# Altium schematic sheet Power Supply Unit (Main).SchDoc: Power Supply Unit
size A4; SPICEModelCacheSEIOAEZJ: <root> / <DocumentId>SEIOAEZJ</DocumentId> / </root>; Revision: 1; SheetNumber: 2; SheetTotal: 5; Units: mm
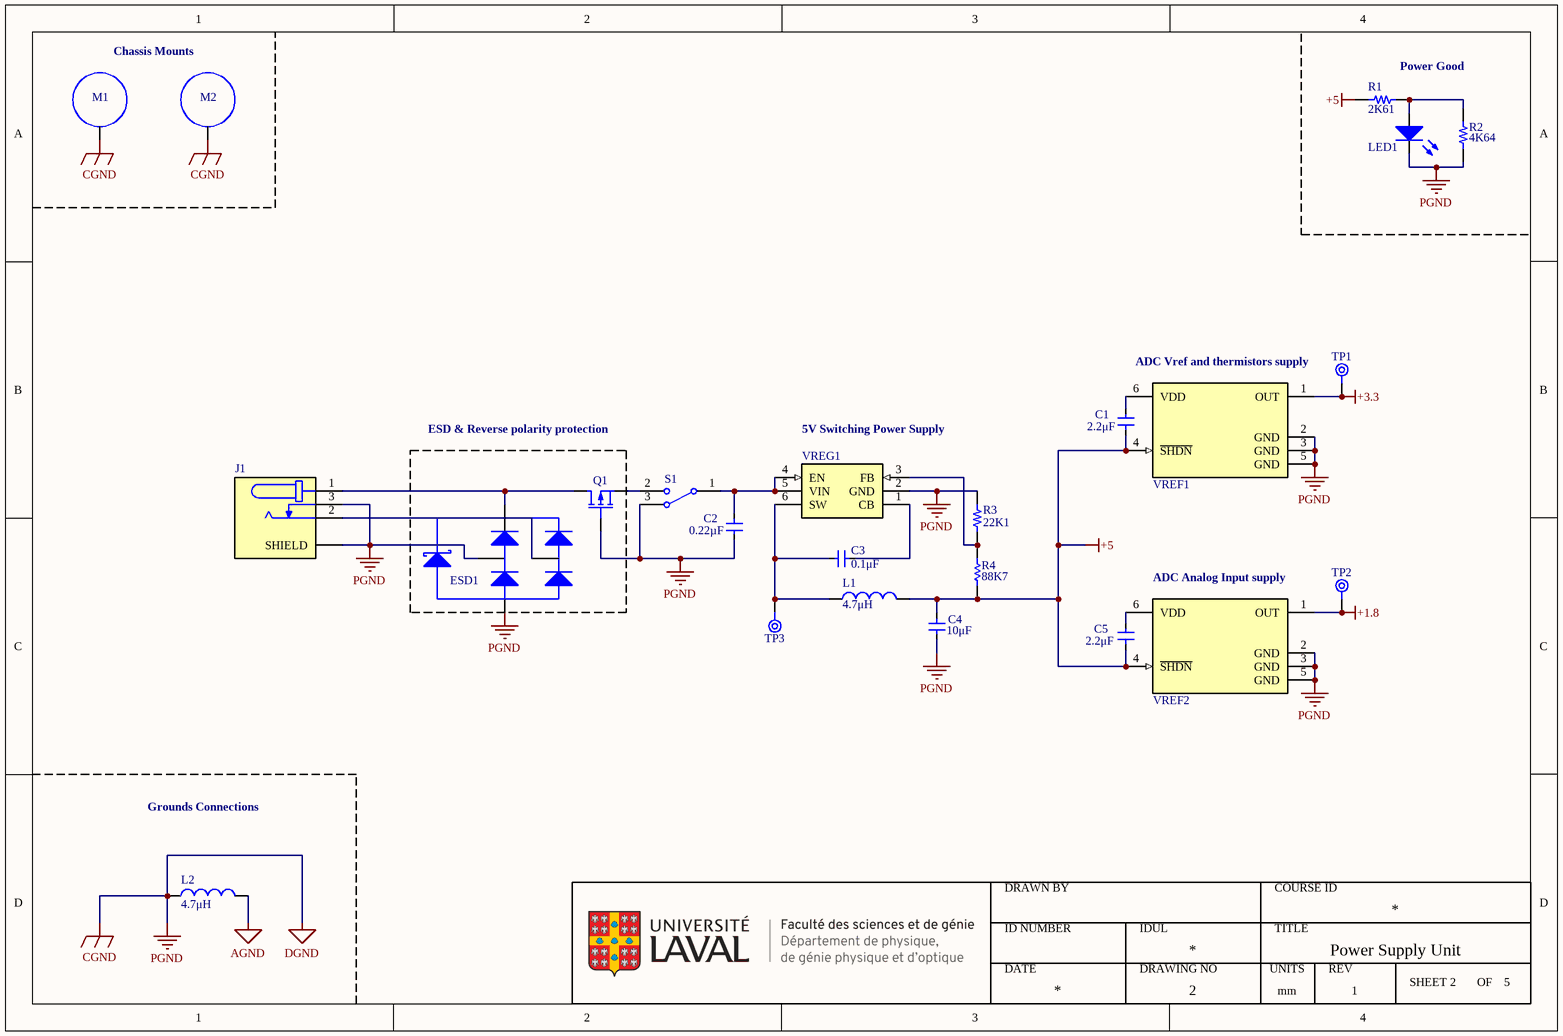
[diagram p0: Power Supply Unit (Main).SchDoc]

## Parts
C1  value 2.2μF  [Cap Ceramic 2.2 uF 6.3V SMT 0603]  (hidden comment: Cap Ceramic 2.2 uF SMT 0603)
C2  Capacitance: 0.22µF  [Cap Ceramic 0.22 uF 25V SMT 0603]  (hidden comment: Cap Ceramic 0.22 uF SMT 0603)
C3  Capacitance: 0.1μF  [Cap Ceramic 0.1 uF 50V SMT 0603]  (hidden comment: Cap Ceramic 0.1 uF SMT 0603)
C4  Capacitance: 10μF  [Cap Ceramic 10 uF SMT 0603]  (hidden comment: GRM188R60J106KE47J)
C5  value 2.2μF  [Cap Ceramic 2.2 uF 6.3V SMT 0603]  (hidden comment: Cap Ceramic 2.2 uF SMT 0603)
ESD1  PRTR5V0U2X,215  [TVS Diode Array Ultra-Low Capacitance]  (value not drawn)
J1  PJ-090BH  [DC Power Jack 2.5 mm]  (value not drawn)
L1  value 4.7μH  [Inductor 4.7 uH SMT 0603]  (hidden comment: ILSB0603ER4R7K)
L2  value 4.7μH  [Inductor 4.7 uH SMT 0603]  (hidden comment: ILSB0603ER4R7K)
LED1  151033GS03000  [Led 3 mm Vertical Clear]  (value not drawn)
M1  R30-3000702  [Standoff M3 7mm Brass]  (value not drawn)
M2  R30-3000702  [Standoff M3 7mm Brass]  (value not drawn)
Q1  IRLML9303TRPBF  [IRLML9303TRPBF]  (value not drawn)
R1  value 2K61  [Resistor Yaego SMT 0603]  (hidden comment: RC0603FR-072K61L)
R2  value 4K64  [Resistor Yaego SMT 0603]  (hidden comment: RC0603FR-074K64L)
R3  Resistance: 22K1  [Resistor Yaego SMT 0603]  (hidden comment: Res 22K1 SMT 0603)
R4  Resistance: 88K7  [Res 88K7 1% SMT 0603]  (hidden comment: Res 88K7 SMT 0603)
S1  TL2230EEF100  [SW DPDT Pushbutton]  (value not drawn)
TP1  Test Point  [SQ Pad]  (value not drawn)  (no BOM)
TP2  Test Point  [SQ Pad]  (value not drawn)  (no BOM)
TP3  Test Point  [SQ Pad]  (value not drawn)  (no BOM)
VREF1  Voltage Reference Series Fixed 3.3V  [MCP1501T-XXE/CHY]  (value not drawn)
VREF2  Voltage Reference Series Fixed 1.8V  [MCP1501T-XXE/CHY]  (value not drawn)
VREG1  Buck Adjustable Switching Reg Pos  [LMR50410YFQDBVRQ1]  (value not drawn)

## Blocks framed on the sheet
ESD & Reverse polarity protection: ESD1 Q1

## Nets
+1.8: TP2.1(TP) VREF2.1(OUT)
+3.3: TP1.1(TP) VREF1.1(OUT)
+5: C1.2 C4.2 C5.2 L1.2 R1.1 R4.2 VREF1.4(~{SHDN}) VREF2.4(~{SHDN})
AGND: L2.2
CGND: C2.1 C4.1 ESD1.1(GND) ESD1.2(I/O_1) J1.3 J1.S1(SHIELD) L2.1 LED1.1(K) M1.1(CGND) M2.1(CGND) Q1.2(G) R2.1 R3.2 S1.3(NO1) VREF1.2(GND) VREF1.3(GND) VREF1.5(GND) VREF2.2(GND) VREF2.3(GND) VREF2.5(GND) VREG1.2(GND)  [also labelled DGND, PGND]
NetC1_1: C1.1 VREF1.6(VDD)
NetC2_2: C2.2 S1.1(NC1) VREG1.4(EN) VREG1.5(VIN)
NetC3_1: C3.1 L1.1 TP3.1(TP) VREG1.6(SW)
NetC3_2: C3.2 VREG1.1(CB)
NetC5_1: C5.1 VREF2.6(VDD)
NetESD1_3: ESD1.3(I/O_2) J1.2
NetESD1_4: ESD1.4(VCC) J1.1 Q1.1(D)
NetLED1_2: LED1.2(A) R1.2 R2.2
NetQ1_3: Q1.3(S) S1.2(COM1)
NetR3_1: R3.1 R4.1 VREG1.3(FB)

## Notes on the sheet
- Chassis Mounts
- (near R1) Power Good
- ADC Vref and thermistors supply
- (near VREG1) 5V Switching Power Supply
- (near VREF2) ADC Analog Input supply
- Grounds Connections
- DRAWN BY
- COURSE ID
- ID NUMBER
- DATE
- IDUL
- DRAWING NO
- TITLE
- UNITS
- REV
- SHEET
- OF

## Library data of the parts
C1 C5 = Cap Ceramic 2.2 uF SMT 0603: 2.2 µF ±10% 6.3V Ceramic Capacitor X7R 0603 (1608 Metric); Part Number: CC0603KRX7R5BB225; manufacturer: Yageo; Applications: General Purpose; ComponentLink1Description: Datasheet; ComponentLink1URL: *; componentlink2description: DigiKey Link; componentlink2url: https://www.digikey.com/en/products/detail/yageo/CC0603KRX7R5BB225/5195203; Device Package: 0603 (1608 Metric); lastupdated: 2023-03-06 20:08:32; Lifecycle Status: Active; Minimum Order: 1; Mounting Type: Surface Mount, MLCC; Operating Temperature: -55°C ~ 125°C; Package / Case: 0603 (1608 Metric); packaging: TapeAndReel; partid: 41539; Part Status: Active; price: 0.01; series: CC; Size / Dimension: 0.063" L x 0.031" W (1.60mm x 0.80mm); Temperature Coefficient: X7R; Thickness (Max): 0.035" (0.90mm); Tolerance: ±10%; Voltage - Rated: 6.3V; Supplier 1: Digi-Key; Supplier Part Number 1: 311-1795-1-ND; Supplier 2: Digi-Key; Supplier Part Number 2: 311-1795-6-ND; Supplier 3: Digi-Key; Supplier Part Number 3: 311-1795-2-ND
C2 = Cap Ceramic 0.22 uF SMT 0603: 0.22 µF ±10% 25V Ceramic Capacitor X7R 0603 (1608 Metric); Part Number: GRM188R71E224KA88D; manufacturer: Murata Electronics; Applications: General Purpose; componentlink1description: Datasheet; componentlink1url: https://www.murata.com/~/media/webrenewal/support/library/catalog/products/capacitor/mlcc/c02e.ashx?la=en-us; componentlink2description: DigiKey Link; componentlink2url: https://www.digikey.com/en/products/detail/murata-electronics/GRM188R71E224KA88D/702554; Device Package: 0603 (1608 Metric); lastupdated: 2023-03-05 20:08:17; Lifecycle Status: Active; Minimum Order: 1; Mounting Type: Surface Mount, MLCC; Operating Temperature: -55°C ~ 125°C; Package / Case: 0603 (1608 Metric); packaging: TapeAndReel; partid: 11196; Part Status: Active; price: 0.01; series: GRM; Size / Dimension: 0.063" L x 0.031" W (1.60mm x 0.80mm); Temperature Coefficient: X7R; Thickness (Max): 0.035" (0.90mm); Tolerance: ±10%; Voltage - Rated: 25V; Supplier 1: Digi-Key; Supplier Part Number 1: 490-3290-1-ND; Supplier 2: Digi-Key; Supplier Part Number 2: 490-3290-6-ND; Supplier 3: Digi-Key; Supplier Part Number 3: 490-3290-2-ND
C3 = Cap Ceramic 0.1 uF SMT 0603: 0.1 µF ±5% 50V Ceramic Capacitor X7R 0603 (1608 Metric); Part Number: CC0603JRX7R9BB104; manufacturer: Yageo; Applications: General Purpose; componentlink1description: Datasheet; componentlink1url: https://www.yageo.com/upload/media/product/productsearch/datasheet/mlcc/UPY-GPHC_X7R_6.3V-to-50V_18.pdf; componentlink2description: DigiKey Link; componentlink2url: https://www.digikey.com/en/products/detail/yageo/CC0603JRX7R9BB104/5195188; Device Package: 0603 (1608 Metric); lastupdated: 2023-03-06 20:08:09; Lifecycle Status: Active; Minimum Order: 1; Mounting Type: Surface Mount, MLCC; Operating Temperature: -55°C ~ 125°C; Package / Case: 0603 (1608 Metric); packaging: TapeAndReel; partid: 12474; Part Status: Active; price: 0.01; series: CC; Size / Dimension: 0.063" L x 0.031" W (1.60mm x 0.80mm); Temperature Coefficient: X7R; Thickness (Max): 0.035" (0.90mm); Tolerance: ±5%; Voltage - Rated: 50V; Supplier 1: Digi-Key; Supplier Part Number 1: 311-1779-1-ND; Supplier 2: Digi-Key; Supplier Part Number 2: 311-1779-6-ND; Supplier 3: Digi-Key; Supplier Part Number 3: 311-1779-2-ND
C4 = Cap Ceramic 10 uF SMT 0603: 10 µF ±10% 6.3V Ceramic Capacitor X5R 0603 (1608 Metric); manufacturer: Murata Electronics; Part Number: GRM188R60J106KE47J; Applications: General Purpose; componentlink2description: DigiKey Link; componentlink2url: https://www.digikey.com/en/products/detail/murata-electronics/GRM188R60J106KE47J/10691412; Device Package: 0603 (1608 Metric); lastupdated: 2023-03-08 20:07:22; Lifecycle Status: Active; Minimum Order: 1; Mounting Type: Surface Mount, MLCC; Operating Temperature: -55°C ~ 85°C; Package / Case: 0603 (1608 Metric); packaging: TapeAndReel; partid: 47219; Part Status: Active; price: 0.01; series: GRM; Size / Dimension: 0.063" L x 0.032" W (1.60mm x 0.80mm); Temperature Coefficient: X5R; Thickness (Max): 0.035" (0.90mm); Tolerance: ±10%; Voltage - Rated: 6.3V; Supplier 1: Digi-Key; Supplier Part Number 1: 490-GRM188R60J106KE47JCT-ND; Supplier 2: Digi-Key; Supplier Part Number 2: 490-GRM188R60J106KE47JDKR-ND; Supplier 3: Digi-Key; Supplier Part Number 3: 490-GRM188R60J106KE47JTR-ND
ESD1 = TVS Diode Array Ultra-Low Capacitance: Clamp Ipp Tvs Diode Surface Mount SOT-143B; Supplier 1: Digi-Key; Supplier Part Number 1: 1727-3884-1-ND; Supplier 2: Digi-Key; Supplier Part Number 2: 1727-3884-6-ND; Supplier 3: Digi-Key; Supplier Part Number 3: 1727-3884-2-ND
J1 = DC Power Jack 2.5 mm Vertical: Power Barrel Connector Jack 2.50mm ID (0.098"), 5.50mm OD (0.217") Through Hole; Current Rating: 5A; Voltage Rating: 25V; Shielding: Shielded; Contact Material: Brass, Copper Alloy; Max Operating Temperature: 85°C; Min Operating Temperature: -25°C; Supplier 1: Digi-Key; Supplier Part Number 1: 102-5562-1-ND; Supplier 2: Digi-Key; Supplier Part Number 2: 102-5562-2-ND; Contact Material - Plating: Silver; Housing Material: Polyamide (PA10T), Nylon 10T
L1 L2 = Inductor 4.7 µH SMT 0603: 4.7 µH Shielded Multilayer Inductor 15 mA 2.1Ohm Max 0603 (1608 Metric); Tolerance: 10%; Core Material: Ferrite; Self Resonant Frequency: 41MHz; Case Code (Imperial): 1206; Min Operating Temperature: -55°C; Max Operating Temperature: 125°C; Width: 1.6mm; Depth: 1.8mm; Weight: 0.000353oz; ComponentLink1Description: Datasheet; ComponentLink1URL: https://www.vishay.com/docs/34029/ilsb1206.pdf; Supplier 1: Digi-Key; Supplier Part Number 1: 541-4369-1-ND; Supplier 2: Digi-Key; Supplier Part Number 2: 541-4369-6-ND
LED1 = LED Green 3mm Vertical: Green 530nm LED Indication - Discrete 3.2V Radial; Supplier 1: Digi-Key; Supplier Part Number 1: 732-5012-ND; Operating Voltage: 3.2V
M1 M2 = Standoff M3 7mm: Hex Standoff Threaded M3x0.5 Brass 0.276" (7.00mm); Supplier 1: Digi-Key; Supplier Part Number 1: 952-1498-ND
Q1 = MOSFET P-Channel 30V SMD: P-Channel 30 V 2.3A (Ta) 1.25W (Ta) Surface Mount Micro3™/SOT-23; Manufacturer: Infineon Technologies; Drain to Source Voltage (Vdss): 30 V; Drive Voltage (Max Rds On,  Min Rds On): 4.5V, 10V; Gate Charge (Qg) (Max) @ Vgs: 2 nC @ 4.5 V; Input Capacitance (Ciss) (Max) @ Vds: 160 pF @ 25 V; Rds On (Max) @ Id, Vgs: 165mOhm @ 2.3A, 10V; Vgs (Max): ±20V; Vgs(th) (Max) @ Id: 2.4V @ 10µA; Part Number: IRLML9303TRPBF; ComponentLink1Description: Datasheet; ComponentLink1URL: https://www.infineon.com/dgdl/irlml9303pbf.pdf?fileId=5546d462533600a401535668ef1d2642; ComponentLink2Description: DigiKey Link; ComponentLink2URL: https://www.digikey.com/en/products/detail/infineon-technologies/IRLML9303TRPBF/2354147; Current - Continuous Drain (Id) @ 25°C: 2.3A (Ta); FET Type: P-Channel; LastUpdated: 2023-03-05 21:05:43; Lifecycle Status: Active; Minimum Order: 1; Mounting Type: Surface Mount; Operating Temperature: -55°C ~ 150°C (TJ); Package / Case: TO-236-3, SC-59, SOT-23-3; Packaging: TapeAndReel; Part Status: Active; Power Dissipation (Max): 1.25W (Ta); Price: 0.11; Series: HEXFET®; Supplier Device Package: Micro3™/SOT-23; Technology: MOSFET (Metal Oxide); Supplier 1: Digi-Key; Supplier Part Number 1: IRLML9303TRPBFCT-ND; Supplier 2: Digi-Key; Supplier Part Number 2: IRLML9303TRPBFDKR-ND; Supplier 3: Digi-Key; Supplier Part Number 3: IRLML9303TRPBFTR-ND
R1 = Res 2K61 1% SMT 0603: 2.61 kOhms ±1% 0.1W, 1/10W Chip Resistor 0603 (1608 Metric) Moisture Resistant Thick Film; Manufacturer: Yageo; Temperature Coefficient: ±100ppm/°C; Part Number: RC0603FR-072K61L; ComponentLink1Description: Datasheet; ComponentLink1URL: https://www.yageo.com/upload/media/product/productsearch/datasheet/rchip/PYu-RC_Group_51_RoHS_L_10.pdf; ComponentLink2Description: DigiKey Link; ComponentLink2URL: https://www.digikey.com/en/products/detail/yageo/RC0603FR-072K61L/727030; Composition: Thick Film; Device Package: 0603 (1608 Metric); Features: Moisture Resistant; Height - Seated (Max): 0.022" (0.55mm); LastUpdated: 2023-03-10 20:29:10; Lifecycle Status: Active; Minimum Order: 1; Number of Terminations: 2; Operating Temperature: -55°C ~ 155°C; Package / Case: 0603 (1608 Metric); Packaging: CutTape; PartId: 19094; Part Status: Active; Power (Watts): 0.1W, 1/10W; Price: 0.01; Resistance: 2K61; Series: RC_L; Size / Dimension: 0.063" L x 0.031" W (1.60mm x 0.80mm); Supplier Device Package: 0603; Tolerance: ±1%; Supplier 1: Digi-Key; Supplier Part Number 1: 311-2.61KHRCT-ND; Supplier 2: Digi-Key; Supplier Part Number 2: 311-2.61KHRDKR-ND; Supplier 3: Digi-Key; Supplier Part Number 3: 311-2.61KHRTR-ND
R2 = Res 4K64 1% SMT 0603: 4.64 kOhms ±1% 0.1W, 1/10W Chip Resistor 0603 (1608 Metric) Moisture Resistant Thick Film; Manufacturer: Yageo; Temperature Coefficient: ±100ppm/°C; Part Number: RC0603FR-074K64L; ComponentLink1Description: Datasheet; ComponentLink1URL: https://www.yageo.com/upload/media/product/productsearch/datasheet/rchip/PYu-RC_Group_51_RoHS_L_10.pdf; ComponentLink2Description: DigiKey Link; ComponentLink2URL: https://www.digikey.com/en/products/detail/yageo/RC0603FR-074K64L/727211; Composition: Thick Film; Device Package: 0603 (1608 Metric); Features: Moisture Resistant; Height - Seated (Max): 0.022" (0.55mm); LastUpdated: 2023-03-10 20:29:36; Lifecycle Status: Active; Minimum Order: 1; Number of Terminations: 2; Operating Temperature: -55°C ~ 155°C; Package / Case: 0603 (1608 Metric); Packaging: CutTape; PartId: 12437; Part Status: Active; Power (Watts): 0.1W, 1/10W; Price: 0.01; Resistance: 4K64; Series: RC_L; Size / Dimension: 0.063" L x 0.031" W (1.60mm x 0.80mm); Supplier 1: DigiKey; Supplier Part Number 1: 311-4.64KHRCT-ND; Supplier Device Package: 0603; Tolerance: ±1%
R3 = Res 22K1 SMT 0603: RES 22.1K OHM 1% 1/10W 0603; Part Number: RC0603FR-0722K1L; Manufacturer: Yageo; Power (Watts): 0.1W, 1/10W; Temperature Coefficient: ±100ppm/°C; ComponentLink1Description: Datasheet; ComponentLink1URL: https://www.yageo.com/upload/media/product/productsearch/datasheet/rchip/PYu-RC_Group_51_RoHS_L_10.pdf; ComponentLink2Description: DigiKey Link; ComponentLink2URL: https://www.digikey.com/en/products/detail/yageo/RC0603FR-0722K1L/727058; Composition: Thick Film; Device Package: 0603 (1608 Metric); Features: Moisture Resistant; Height - Seated (Max): 0.022" (0.55mm); LastUpdated: 2023-03-08 20:29:23; Lifecycle Status: Active; Minimum Order: 1; Number of Terminations: 2; Operating Temperature: -55°C ~ 155°C; Package / Case: 0603 (1608 Metric); Packaging: CutTape; PartId: 19017; Part Status: Active; Price: 0.01; Series: RC_L; Size / Dimension: 0.063" L x 0.031" W (1.60mm x 0.80mm); Supplier Device Package: 0603; Tolerance: ±1%; Supplier 1: Digi-Key; Supplier Part Number 1: 311-22.1KHRCT-ND; Supplier 2: Digi-Key; Supplier Part Number 2: 311-22.1KHRDKR-ND; Supplier 3: Digi-Key; Supplier Part Number 3: 311-22.1KHRTR-ND; Value: 22K1
R4 = Res 88K7 SMT 0603: 88.7 kΩ ±1% 0.1W, 1/10W Chip Resistor 0603 (1608 Metric) Automotive AEC-Q200 Thick Film; Part Number: CRCW060388K7FKEB; Manufacturer: Vishay Dale; Temperature Coefficient: ±100ppm/°C; ComponentLink1Description: Datasheet; ComponentLink1URL: http://www.vishay.com/docs/20035/dcrcwe3.pdf; ComponentLink2Description: DigiKey Link; ComponentLink2URL: https://www.digikey.com/en/products/detail/vishay-dale/CRCW060388K7FKEB/5073407; Composition: Thick Film; Device Package: 0603 (1608 Metric); Features: Automotive AEC-Q200; Height - Seated (Max): 0.020" (0.50mm); LastUpdated: 2023-03-06 20:27:22; Lifecycle Status: Active; Minimum Order: 1; Number of Terminations: 2; Operating Temperature: -55°C ~ 155°C; Package / Case: 0603 (1608 Metric); Packaging: CutTape; PartId: 56612; Part Status: Active; Power (Watts): 0.1W, 1/10W; Price: 0.01; Ratings: AEC-Q200; Series: CRCW; Size / Dimension: 0.063" L x 0.033" W (1.60mm x 0.85mm); Supplier Device Package: 0603; Tolerance: ±1%; Supplier 1: Digi-Key; Supplier Part Number 1: 541-CRCW060388K7FKEBCT-ND; Supplier 2: Digi-Key; Supplier Part Number 2: 541-CRCW060388K7FKEBDKR-ND
S1 = SW DPDT Pushbutton V2: Pushbutton Switch DPDT Standard Through Hole; Published: 24-Mar-1999; LatestRevisionDate: 29-May-2009; LatestRevisionNote: IPC-7351 Footprint Added.; PackageVersion: Mar-2001; PackageReference: SOT23-6; Publisher: Altium Limited; PackageDescription: 6-Pin SOT-23 Package 0.95 mm Pitch, 2.7 mm Lead Span; Code_JEITA: SC-74; Code_IPC: SOT26A-6; Supplier 1: Digi-Key; Supplier Part Number 1: EG6030-ND
VREF1 = Voltage Reference Series Fixed 3.3V: Series Voltage Reference IC Fixed 3.3V V ±0.1% 20 mA SOT-23-6; Temperature Coefficient: 50ppm/°C; Output Current: 20mA; Tolerance: 0.08%; Operating Supply Current: 550μA; ComponentLink1Description: Datasheet; ComponentLink1URL: https://ww1.microchip.com/downloads/aemDocuments/documents/MSLD/ProductDocuments/DataSheets/MCP1501-Data-Sheet-DS20005474F.pdf; Reference Type: Series; Case/Package: SOT-23-6; Output Type: Fixed; Min Output Voltage: 3.3V; Min Operating Temperature: -40°C; Max Operating Temperature: 125°C; Supplier 1: Digi-Key; Supplier Part Number 1: MCP1501T-33E/CHYCT-ND; Supplier 2: Digi-Key; Supplier Part Number 2: MCP1501T-33E/CHYDKR-ND; Supplier 3: Digi-Key; Supplier Part Number 3: MCP1501T-33E/CHYTR-ND
VREF2 = Voltage Reference Series Fixed 1.8V: Series Voltage Reference IC Fixed 1.8V V ±0.1% 20 mA SOT-23-6; Temperature Coefficient: 50ppm/°C; Output Current: 20mA; Tolerance: 0.08%; Operating Supply Current: 550μA; ComponentLink1Description: Datasheet; ComponentLink1URL: https://ww1.microchip.com/downloads/aemDocuments/documents/MSLD/ProductDocuments/DataSheets/MCP1501-Data-Sheet-DS20005474F.pdf; Reference Type: Series; Case/Package: SOT-23-6; Output Type: Fixed; Min Output Voltage: 1.8V; Min Operating Temperature: -40°C; Max Operating Temperature: 125°C; Supplier 1: Digi-Key; Supplier Part Number 1: MCP1501T-18E/CHYCT-ND; Supplier 2: Digi-Key; Supplier Part Number 2: MCP1501T-18E/CHYDKR-ND
VREG1 = Buck Adjustable Switching Reg Pos: Buck Switching Regulator IC Positive Adjustable 1V 1 Output 1A SOT-23-6; Manufacturer_Name: Texas Instruments; Datasheet Link: https://www.ti.com/product/LMR50410-Q1; Height: 1.45mm; Manufacturer_Part_Number: LMR50410YFQDBVRQ1; Mouser Part Number: 595-MR50410YFQDBVRQ1; Mouser Price/Stock: https://www.mouser.co.uk/ProductDetail/Texas-Instruments/LMR50410YFQDBVRQ1?qs=81r%252BiQLm7BRUAgUFqYZycA%3D%3D; Arrow Part Number: LMR50410YFQDBVRQ1; Arrow Price/Stock: https://www.arrow.com/en/products/lmr50410yfqdbvrq1/texas-instruments?region=nac; Supplier 1: Digi-Key; Supplier Part Number 1: 296-LMR50410YFQDBVRQ1CT-ND; Supplier 2: Digi-Key; Supplier Part Number 2: 296-LMR50410YFQDBVRQ1DKR-ND; Supplier 3: Digi-Key; Supplier Part Number 3: 296-LMR50410YFQDBVRQ1TR-ND